# Altium schematic sheet Transducer.SchDoc
size A4; Author: Esteban Durán Madrid; CompanyName: Universidad de Santiago de Chile; Address1: Avenida Ecuador Nº 3519; Address2: Estación Central, Santiago; Address3: Chile; DocumentNumber: 3; SheetNumber: 3; SheetTotal: 3
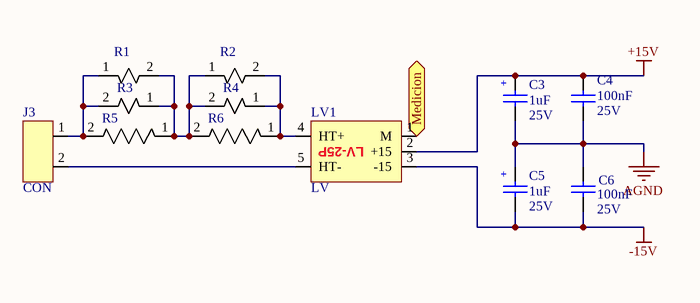
[diagram p0: Transducer.SchDoc]

## Parts
C3  1uF  Voltage: 25V  [CAP_1206 Tantalio]
C4  100nF  Voltage: 25V  [CAP_0805]
C5  1uF  Voltage: 25V  [CAP_1206 Tantalio]
C6  100nF  Voltage: 25V  [CAP_0805]
J3  CON  [CON_282858-2]
LV1  LV  [LEM_LV 25-P]
R1  RES  [RES_MP925-15.0K-1%]  (value not drawn)
R2  RES  [RES_MP925-15.0K-1%]  (value not drawn)
R3  RES  [RES_MP925-15.0K-1%]  (value not drawn)
R4  RES  [RES_MP925-15.0K-1%]  (value not drawn)
R5  RES  [RES_RS00515K00FE73]  (value not drawn)
R6  RES  [RES_RS00515K00FE73]  (value not drawn)

## Ports
Medicion

## Nets
+15V: C3.1 C4.1 LV1.2(+15)
-15V: C5.2 C6.2 LV1.3(-15)
AGND: C3.2 C4.2 C5.1 C6.1
Medicion: LV1.1(M) ; port Medicion
NetJ3_1: J3.1 R1.1(C) R3.2(A) R5.2(A)
NetJ3_2: J3.2 LV1.5(HT-)
NetLV1_4: LV1.4(HT+) R2.2(A) R4.1(C) R6.1(C)
NetR1_2: R1.2(A) R2.1(C) R3.1(C) R4.2(A) R5.1(C) R6.2(A)

## Notes on the sheet
- Title
- Size:
- Date:
- A4
- Revision:
- Time:
- Sheet
- of
- Author:
- Project:
- (in symbol Cap Tantalio 1206) +
- (in symbol LEM_LV 25-P) LV-25P

## Library data of the parts
C3 C5 = Cap Tantalio 1206: Capacitor Tantalio; Manufacturer Part-Number: T491A105K025AT; Digikey Part-Number: 399-3680-1-ND; Value: 1uF
C4 C6 = Cap_0805: Capacitor; Manufacturer Part-Number: C0805C104K3RACTU; Digikey Part-Number: 399-1168-2-ND; Value: 100nF
J3 = CON_282858-2: 282858-2; Digikey Part-Number: A98113-ND; Manufacturer Part-Number: 282858-2
LV1 = LEM_LV 25-P: LV 25-P
R1 R2 = RES_MP925-15.0K-1%: RES 50K OHM 25W 1% TO220; Digikey Part-Number: MP925-50.0KF-ND
R3 R4 = RES_MP925-15.0K-1%: MP925-15.0K-1%
R5 R6 = RES_RS00515K00FE73: RS00515K00FE73